# EAGLE design board (EAGLE 7.6.0)
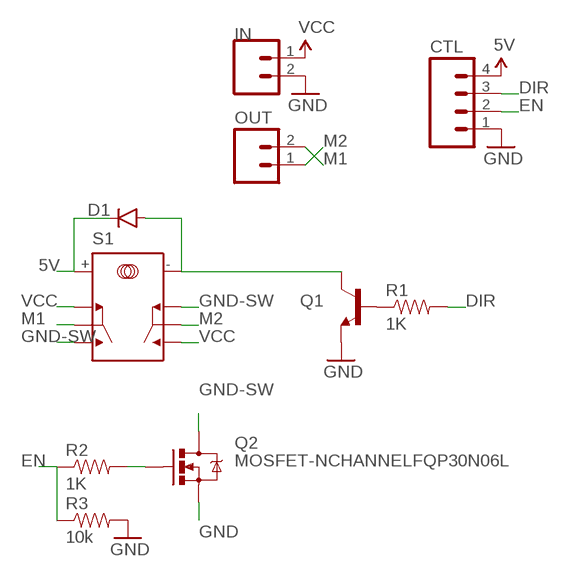
[diagram p0: schematic, sheet 1]

## Parts
CTL  M041X04_NO_SILK  [1X04_NO_SILK]
D1  DIODE1N4148  [DIODE-1N4148]
IN  M023.5MM  [SCREWTERMINAL-3.5MM-2]
OUT  M023.5MM  [SCREWTERMINAL-3.5MM-2]
Q1  TRANSISTOR_NPNTO-92-AMMO  [TO-92-AMMO]
Q2  MOSFET-NCHANNELFQP30N06L  [TO220V]
R1  1K  1KOHM-1/4W-1%(PTH)  [AXIAL-0.3]
R2  1K  1KOHM-1/4W-1%(PTH)  [AXIAL-0.3]
R3  10k  10KOHM-1/4W-1%(PTH)HORIZ  [AXIAL-0.3]
S1  EC2-5NU  [EC2-5NU]

## Nets
5V: CTL.4 D1.C S1.+
$1: D1.A Q1.3(C) S1.-
DIR: CTL.3 R1.P$2
EN: CTL.2 R2.P$1 R3.P$1
GND: CTL.1 IN.2 Q1.1(E) Q2.3(S) R3.P$2
GND-SW: Q2.2(D) S1.NC2 S1.NO1
M1: OUT.2 S1.COM1
M2: OUT.1 S1.COM2
N$1: Q2.1(G) R2.P$2
N$2: Q1.2(B) R1.P$1
VCC: IN.1 S1.NC1 S1.NO2

## Library data of the parts
CTL = SparkFun-Connectors:M04: Header 4 Standard 4-pin 0.1" header. Use with straight break away headers (SKU : PRT-00116), right angle break away headers (PRT-00553), swiss pins (PRT-00743), machine pins (PRT-00117), and female headers (PRT-00115). Molex polarized connector foot print use with SKU : PRT-08231 with associated crimp pins and housings. 1MM SMD Version SKU: PRT-10208
D1 = SparkFun-DiscreteSemi:DIODE: Diode These are standard reverse protection diodes and small signal diodes. SMA package can handle up to about 1A. SOD-323 can handle about 200mA. What the SOD-323 package when ordering, there are some mfgs out there that are 5-pin packages.
IN OUT = SparkFun-Connectors:M02: Standard 2-pin 0.1" header. Use with - straight break away headers ( PRT-00116) - right angle break away headers (PRT-00553) - swiss pins (PRT-00743) - machine pins (PRT-00117) - female headers (PRT-00115) Molex polarized connector foot print use with: PRT-08233 with associated crimp pins and housings. 2.54_SCREWTERM for use with PRT-10571. 3.5mm Screw Terminal footprints for PRT-08084 5mm Screw Terminal footprints for use with PRT-08432; PROD_ID: CONN-08399
Q1 = SparkFun-DiscreteSemi:TRANSISTOR_NPN: Generic NPN BJT MMBT2222A - TRANS-08049 (SOT-23, 1A 40V) MPSA42 - TRANS-09116 (SOT-23, 500mA 300V) MMBT5088LT1G - TRANS-11160 (SOT-23, 50 mA 30V) BC547 - COM-08928 <http://www.sparkfun.com/products/8928> (TO-92 45V 100mA) (1.Collector 2.Base 3.Emitter) 2N3904 - COM-00521 <http://www.sparkfun.com/products/521> (TO-92 40V 200mA) (1.Emitter 2.Base 3.Collector) P2N2222A - COM-12852 <http://www.sparkfun.com/products/12852> (TO-92 40V 600mA) (1.Collector 2.Base 3.Emitter)
Q2 = SparkFun-DiscreteSemi:MOSFET-NCHANNEL: Common NMOSFET Parts MFG P/N Store ID Prod ID FDD8780 TRANS-09984 SI7820DN TRANS-11055 FDS6630A IC-08089 2N7002PW TRANS-11151 FQP30N06L COM-10213 TRANS-10060 BSS123LT1G TRANS-08345 BSS138 TRANS-00830 BS170 2N7000; PROD_ID: TRANS-10060
R1 R2 = SparkFun-Resistors:1KOHM-1/4W-1%(PTH): RES-12182; PROD_ID: RES-12182
R3 = SparkFun-Resistors:10KOHM-1/4W-1%(PTH): RES-12183; PROD_ID: RES-12183
S1 = custom-parts:EC2-5NU

## Board
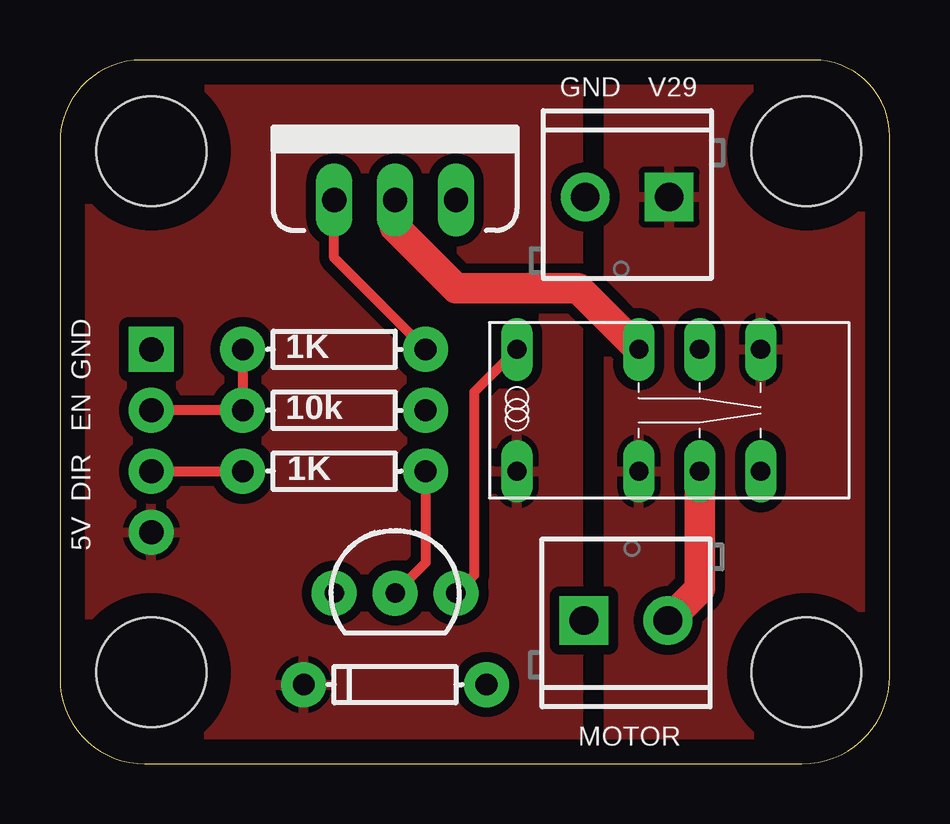
[diagram p1: board, top side]
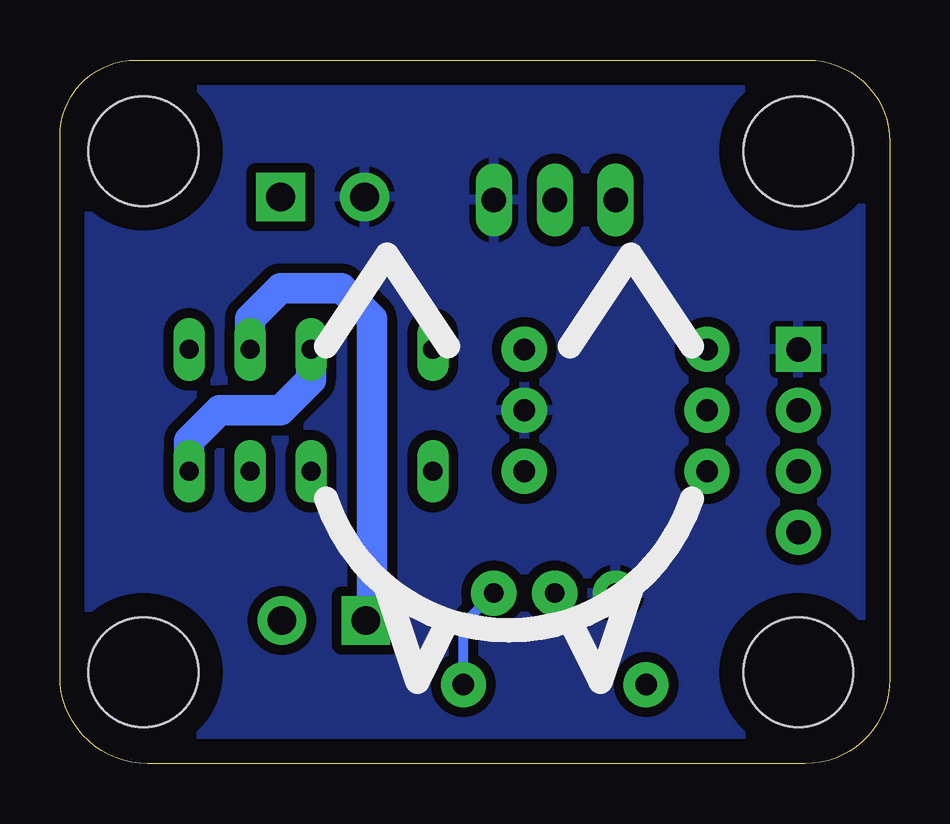
[diagram p2: board, bottom side, seen from below]

Size 34.59 x 29.33 mm. Coordinates in mm from the lower left corner, seen from the top.
Outline: 0,25.92 0,3.54 arc90 3.54,0 30.94,0 arc90 34.59,3.66 34.59,26.15 arc90 31.41,29.33 3.41,29.33 arc90 0,25.92
Copper layers (1*16): Top 0.035mm / dielectric 1.5mm / Bottom 0.035mm
Design rules "default": minimum track width 10mil, minimum drill 24mil, track to track 8mil, track to pad 8mil, pad to pad 8mil, via to via 8mil, smd to smd 8mil, copper to edge 40mil, drill to drill 8mil, minimum pad ring 10mil, minimum via ring 8mil, stop-mask expansion 4mil, vias tented up to drill 0mil, thermal gap 10mil
Holes 4.57 mm at 31.11,3.81 31.11,25.53 3.81,25.53 3.81,3.81

### Footprints (pad centres in the part's own frame; a part is rotated, then mirrored left to right if it is on the bottom)
1X04_NO_SILK = drill 1.016 pad 1.88 square: 1 0,0 | drill 1.016 pad 1.88: 2 2.54,0; 3 5.08,0; 4 7.62,0
DIODE-1N4148 = drill 0.9 pad 1.88: A -3.81,0; C 3.81,0
SCREWTERMINAL-3.5MM-2 = drill 1.2 pad 2.032 square: 1 0,0 | drill 1.2 pad 2.032: 2 3.5,0
TO-92-AMMO = drill 0.813 pad 1.88: 1 -2.54,0; 2 0,0; 3 2.54,0
TO220V = drill 1.016 long: 1 -2.54,0; 2 0,0; 3 2.54,0
AXIAL-0.3 = drill 0.9 pad 1.88: P$1 -3.81,0; P$2 3.81,0
EC2-5NU = drill 0.8 long: + -6.35,-2.54; - -6.35,2.54; COM1 1.27,-2.54; COM2 1.27,2.54; NC1 -1.27,-2.54; NC2 -1.27,2.54; NO1 3.81,-2.54; NO2 3.81,2.54

### Placement (x,y rotation side)
CTL  3.81,17.27 270 top
D1  13.97,3.3 180 top
IN  25.4,23.62 180 top
OUT  21.84,5.97 0 top
Q1  13.97,7.11 0 top
Q2  13.97,23.5 0 top
R1  11.43,12.19 180 top
R2  11.43,17.27 0 top
R3  11.43,14.73 0 top
S1  25.4,14.73 0 top

### Tracks (layer width: path | path; a pad name or v marks a point on that pad's centre or on a via)
5V
  pour Top (isolate 0.406): 0,29.97 21.59,29.97 21.59,-0.51 0,-0.51
$1
  Top 0.406: Q1.3 17.27,7.87 17.27,15.49 S1.-
  Bottom 0.406: D1.A 17.78,5.84 Q1.3
DIR
  Top 0.406: CTL.3 R1.P$2
EN
  Top 0.406: R2.P$1 R3.P$1 CTL.2
GND
  pour Bottom (isolate 0.406): -1.27,-1.78 39.37,-1.78 39.37,31.24 -1.27,31.24
GND-SW
  Top 1.27: Q2.2 13.97,22.35 16.51,19.81 21.59,19.81 S1.NC2
  Bottom 1.27: S1.NC2 24.13,16 25.4,14.73 27.94,14.73 29.21,13.46 S1.NO1
M1
  Top 1.27: S1.COM1 26.67,7.29 OUT.2
M2
  Bottom 1.27: S1.COM2 26.67,18.54 25.4,19.81 22.86,19.81 21.59,18.54 21.59,6.22 OUT.1
N$1
  Top 0.406: R2.P$2 11.43,21.08 Q2.1
N$2
  Top 0.406: R1.P$1 15.24,8.38 Q1.2
VCC
  pour Top (isolate 0.406): 38.1,29.97 22.86,29.97 22.86,-0.51 38.1,-0.51

### Text on the board
tPlace: GND | V29 | GND | EN | DIR | 5V | MOTOR